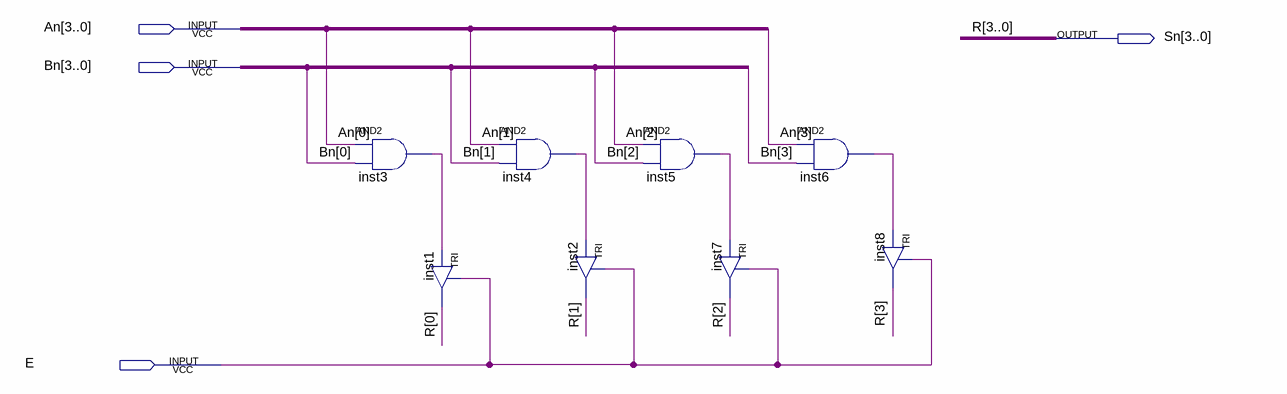
[diagram p0: schematic sheet]
// Quartus schematic And4bits.bdf as structural Verilog: 8 symbols, 4 pins
module And4bits (
  input  [3:0] An,
  input  [3:0] Bn,
  input  E,
  output [3:0] Sn
);

  wire inst3_out, inst4_out, inst5_out, inst6_out;

  and inst3 (inst3_out, An[0], Bn[0]);
  TRI inst1 (.IN(inst3_out), .OE(E), .OUT(Sn[0]));
  and inst4 (inst4_out, An[1], Bn[1]);
  TRI inst2 (.IN(inst4_out), .OE(E), .OUT(Sn[1]));
  and inst5 (inst5_out, An[2], Bn[2]);
  TRI inst7 (.IN(inst5_out), .OE(E), .OUT(Sn[2]));
  and inst6 (inst6_out, An[3], Bn[3]);
  TRI inst8 (.IN(inst6_out), .OE(E), .OUT(Sn[3]));

  // Other names for the same wires on the sheet: R[3:0] = Sn
endmodule
